# Altium schematic sheet MezzanineConnectors.SchDoc
size 420 x 297 mm; SheetNumber: 9; SheetTotal: 10; PageSetup: Record=PageOptions|CenterHorizontal=True|CenterVertical=True|PrintScale=0.96|XCorrection=1.00|YCorrection=1.00|PrintKind=1|BorderSize=5000000|LeftOffset=0|BottomOffset=0|Orientation=2|PaperLength=4318|PaperWidth=2794|Scale=100|PaperSource=7|PrintQuality=600|MediaType=1|DitherType=10|PaperKind=11" x 17"|PrintScaleMode=1
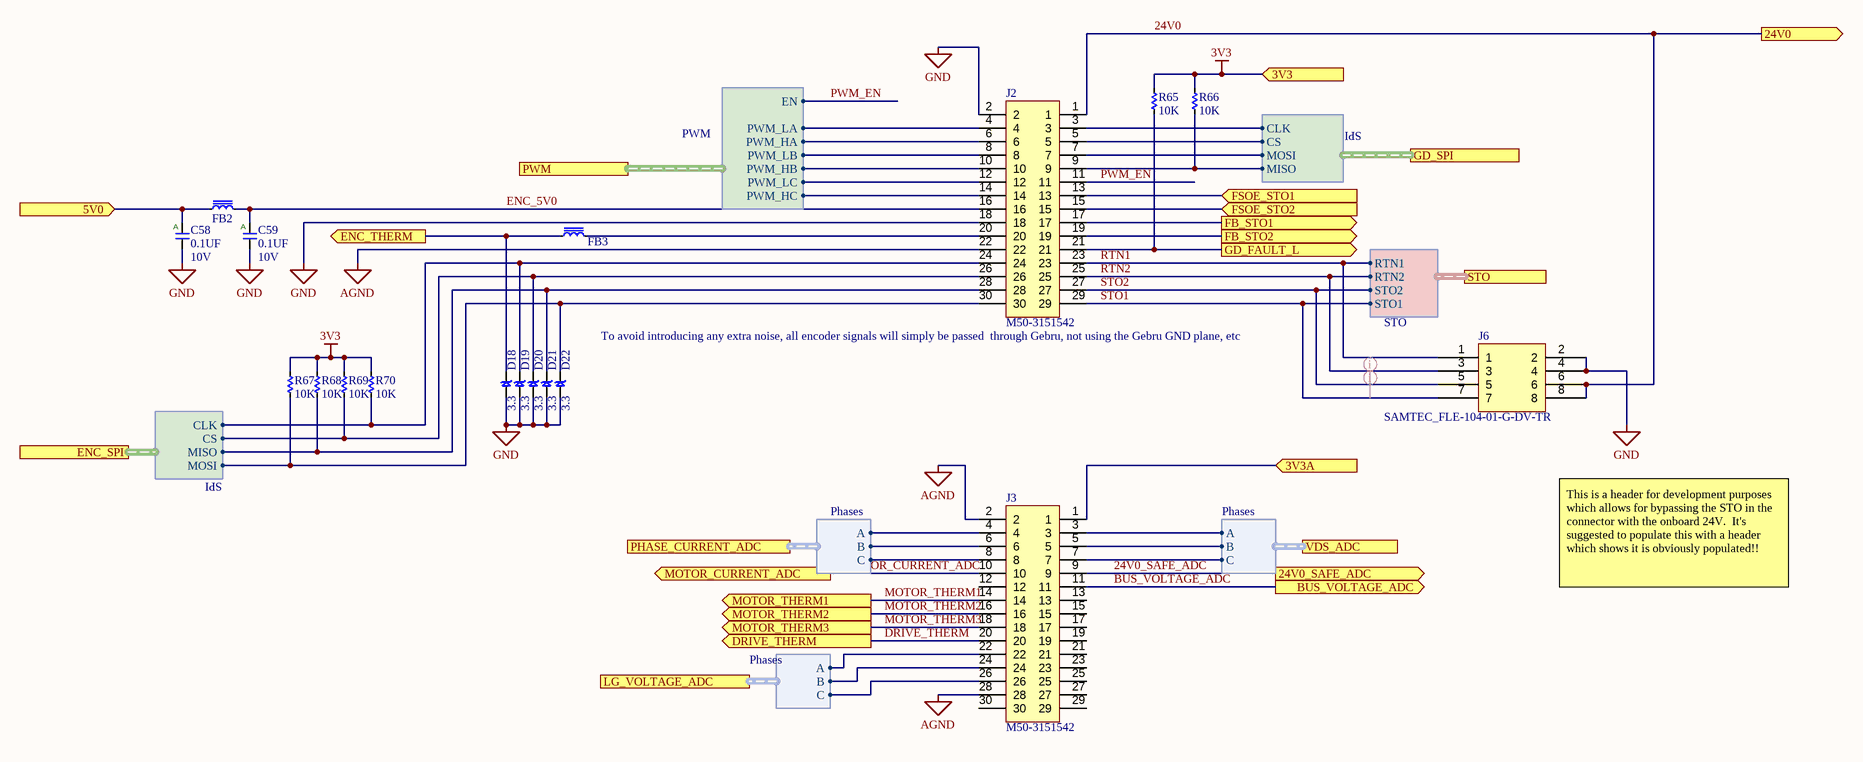
[diagram p0: MezzanineConnectors.SchDoc]

## Parts
C58  value 0.1UF  Voltage: 10V  [C0201Y]  (hidden comment: __Template_Cap_Auto)
C59  value 0.1UF  Voltage: 10V  [C0201Y]  (hidden comment: __Template_Cap_Auto)
D18  3.3  [SOD1060X40]
D19  3.3  [SOD1060X40]
D20  3.3  [SOD1060X40]
D21  3.3  [SOD1060X40]
D22  3.3  [SOD1060X40]
FB2  LAIRD MI0603L221R-10  [INDC160X80X105L30N]  (value not drawn)
FB3  LAIRD MI0603L221R-10  [INDC160X80X105L30N]  (value not drawn)
J2  MFG P/N: M50-3151542  [HARWIN_M50-3151542]
J3  MFG P/N: M50-3151542  [HARWIN_M50-3151542]
J6  SAMTEC_FLE-104-01-G-DV-TR  [SAMTEC_FLE-104-01-G-DV-TR]
R65  value 10K  [R0201_H0.26MM]  (hidden comment: __Template_Resistor)
R66  value 10K  [R0201_H0.26MM]  (hidden comment: __Template_Resistor)
R67  value 10K  [R0201_H0.26MM]  (hidden comment: __Template_Resistor)
R68  value 10K  [R0201_H0.26MM]  (hidden comment: __Template_Resistor)
R69  value 10K  [R0201_H0.26MM]  (hidden comment: __Template_Resistor)
R70  value 10K  [R0201_H0.26MM]  (hidden comment: __Template_Resistor)

## Ports
3V3 (in), 3V3A (in), 5V0 (in), 24V0 (out), 24V0_SAFE_ADC (out), BUS_VOLTAGE_ADC (out), DRIVE_THERM (out), ENC_SPI (harness SPI), ENC_THERM (out), FB_STO1 (out), FB_STO2 (out), FSOE_STO1 (in), FSOE_STO2 (in), GD_FAULT_L (out), GD_SPI (harness SPI), LG_VOLTAGE_ADC (harness Phases), MOTOR_CURRENT_ADC (out), MOTOR_THERM1 (out), MOTOR_THERM2 (out), MOTOR_THERM3 (out), PHASE_CURRENT_ADC (harness Phases), PWM (harness PWM), STO (harness STO), VDS_ADC (harness Phases)

## Harnesses
Phases: A, B, C
PWM: EN, PWM_HA, PWM_LA, PWM_HB, PWM_LB, PWM_HC, PWM_LC
SPI: CLK, CS, MOSI, MISO
STO: RTN1, RTN2, STO1, STO2

## Nets
3V3: R65.2 R66.2 R67.2 R68.2 R69.2 R70.2 ; port 3V3
AGND: J2.22 J3.2 J3.28
GND: C58.2 C59.2 D18.A D19.A D20.A D21.A D22.A J2.2 J2.18 J6.2 J6.4
3V3A: J3.1 ; port 3V3A
5V0: C58.1 FB2.1 ; port 5V0
24V0: J2.1 J6.6 J6.8 ; port 24V0
24V0_SAFE_ADC: J3.9 ; port 24V0_SAFE_ADC
BUS_VOLTAGE_ADC: J3.11 ; port BUS_VOLTAGE_ADC
DRIVE_THERM: J3.20 ; port DRIVE_THERM
ENC_5V0: C59.1 FB2.2 J2.16
ENC_THERM: D18.K FB3.1 ; port ENC_THERM
FB_STO1: J2.17 ; port FB_STO1
FB_STO2: J2.19 ; port FB_STO2
FSOE_STO1: J2.13 ; port FSOE_STO1
FSOE_STO2: J2.15 ; port FSOE_STO2
GD_FAULT_L: J2.21 R65.1 ; port GD_FAULT_L
MOTOR_CURRENT_ADC: J3.10 ; port MOTOR_CURRENT_ADC
MOTOR_THERM1: J3.14 ; port MOTOR_THERM1
MOTOR_THERM2: J3.16 ; port MOTOR_THERM2
MOTOR_THERM3: J3.18 ; port MOTOR_THERM3
PWM_EN: J2.11 ; port PWM.EN
RTN1: J2.23 J6.1 ; port STO.RTN1
RTN2: J2.25 J6.3 ; port STO.RTN2
STO1: J2.29 J6.7 ; port STO.STO1
STO2: J2.27 J6.5 ; port STO.STO2
NetD19_K: D19.K J2.24 R70.1 ; port ENC_SPI.CLK
NetD20_K: D20.K J2.26 R69.1 ; port ENC_SPI.CS
NetD21_K: D21.K J2.28 R68.1 ; port ENC_SPI.MISO
NetD22_K: D22.K J2.30 R67.1 ; port ENC_SPI.MOSI
NetFB3_2: FB3.2 J2.20
NetJ2_3: J2.3 ; port GD_SPI.CLK
NetJ2_4: J2.4 ; port PWM.PWM_LA
NetJ2_5: J2.5 ; port GD_SPI.CS
NetJ2_6: J2.6 ; port PWM.PWM_HA
NetJ2_7: J2.7 ; port GD_SPI.MOSI
NetJ2_8: J2.8 ; port PWM.PWM_LB
NetJ2_9: J2.9 R66.1 ; port GD_SPI.MISO
NetJ2_10: J2.10 ; port PWM.PWM_HB
NetJ2_12: J2.12 ; port PWM.PWM_LC
NetJ2_14: J2.14 ; port PWM.PWM_HC
NetJ3_3: J3.3 ; port VDS_ADC.A
NetJ3_4: J3.4 ; port PHASE_CURRENT_ADC.A
NetJ3_5: J3.5 ; port VDS_ADC.B
NetJ3_6: J3.6 ; port PHASE_CURRENT_ADC.B
NetJ3_7: J3.7 ; port VDS_ADC.C
NetJ3_8: J3.8 ; port PHASE_CURRENT_ADC.C
NetJ3_22: J3.22 ; port LG_VOLTAGE_ADC.A
NetJ3_24: J3.24 ; port LG_VOLTAGE_ADC.B
NetJ3_26: J3.26 ; port LG_VOLTAGE_ADC.C

Not connected (* = marked no-connect by the designer): J3 12 13 15 17 19 21 23 25 27 29 30

## Layout directives
net class 24V: STO1, STO2

## Notes on the sheet
- (near J2) To avoid introducing any extra noise, all encoder signals will simply be passed
  through Gebru, not using the Gebru GND plane, etc
- This is a header for development purposes which allows for bypassing the STO in the connector with the onboard 24V.  It's suggested to populate this with a header which shows it is obviously populated!!
- CREATIVE COMMONS
- PUBLIC LICENSE:
- BARKOUR ROBOT
- CC BY-NC 4.0
- APPROVED
- DWG NO
- GOOGLE LLC
- FILE
- RELEASED
- 2024/05/09
- SIZE
- 1600 AMPHITHEATRE PARKWAY
- MOUNTAIN VIEW CA 94043
- A3
- SHEET
- OF
- THIS DESIGN IS BEING PROVIDED  FOR NON-COMMERCIAL USE ONLY. THE USE OF =SCIENTIST_NAME_POSSESSIVE NAME IN CONNECTION WITH THE DESIGN IS NOT INTENDED TO IMPLY THAT =SCIENTIST_NAME SPONSORS OR ENDORSES THE DESIGN, GOOGLE LLC, OR ANY OF GOOGLE LLC'S PRODUCTS OR SERVICES.
- (in symbol 934) A

## Library data of the parts
C58 C59 = 934: CAP, CER, X6S, 0.1uF, 10V, 10%, 0201, AUTOGRADE; ID: 934; MFG: MURATA; MFG P/N: GRT033C81A104KE01D; XPN: 150-01178-00; Gecko: 150-04546-00; EES: 150-04563-00; Status: Released; Package: 0201; Dielectric: X6S; Tolerance: 10%; Height: 0.33mm T; Supplier 1: Digi-key; HelpURL: https://www.digikey.com/product-detail/en/murata-electronics/GRT033C81A104KE01D/490-12232-1-ND/5416933; ComponentLink1Description: Datasheet; ComponentLink1URL: https://search.murata.co.jp/Ceramy/image/img/A01X/G101/ENG/GRT033C81A104KE01-01.pdf; COMMON: 150-01178-00; LOON: 150-01178-00; Supplier Part Number 1: 490-12232-1-ND
D18-D22 = 192: TVS, DIODE, UNIDIR, 3.3VRWM, 4.8VBR, 7.8VCL, SOD-923; ID: 192; MFG: ON Semiconductor; MFG P/N: ESD9R3.3ST5G; Value: ESD9R3.3ST5G; Diode Type: Zener; PROXY: 480-01364-00; LOON: 430-00045-00; Voltage - Clamping (Max) @ Ipp: 7.8V; Status: Released; Package: SOD-923; Category: Diode; RoHS Compliant: Yes; Mounting Type: SMD; Operating Temperature – Junction: -55°C ~ 125°C (TJ); Supplier 1: Digi-Key; HelpURL: https://www.digikey.in/product-detail/en/on-semiconductor/ESD9R3.3ST5G/ESD9R3.3ST5GOSCT-ND/2704997; ComponentLink1Description: Datasheet; ComponentLink1URL: http://www.onsemi.com/pub/Collateral/ESD9R3.3S-D.PDF; Height: 0.4mm; Supplier Part Number 1: ESD9R3.3ST5GOSCT-ND
FB2 FB3 = LAIRD_MI0603L221R-10: LAIRD - MI0603L221R-10 - Ferrite Bead, 0603 [1608 Metric], 220 ohm, 2 A, MI Series, 0.05 ohm; Manufacturer: Laird Technologies; Grade: Commercial; Value: 220 Ohms @ 100 MHz; Current Rating: 2A; Number of Lines: 1; DC Resistance (DCR): 50mR; Impedance: 220R; Test Frequency: 100MHz; Shielding: Unshielded; Manufacturer Part Number: MI0603L221R-10; Package: Inductor, 0603; ComponentLink1Description: Datasheet; ComponentLink1URL: https://media.digikey.com/pdf/Data%20Sheets/Laird%20Technologies/EMI_Filtering_and_RF_Inductors.pdf; Category: Ferrite Beads; Status: Preliminary; Storage Temperature: -40 °C ~ 125 °C; Operating Temperature: -40 °C ~ 125 °C; Supplier 1: Mouser; Supplier Part Number 1: 875-MI0603L221R-10; RoHS: Yes; Stock 1: 2603; Pricing 1: 1=0.10000, 10=0.07000, 50=0.06400, 100=0.06400, 250=0.06000, 500=0.05600, 1000=0.05000, 4000=0.04800, 10000=0.04800 (USD); Mount: Surface Mount; Case/Package: 0603; Case Code (Metric): 1608; Case Code (Imperial): 0603; Weight: 0.000192oz; Core Material: Ferrite; Material: Ferrite; Min Operating Temperature: -40°C; Max Operating Temperature: 125°C; Packaging: Tape and Reel; Package Quantity: 1; Max Current Rating: 2A; Series: MI; Max DC Current: 2A; Termination: SMD/SMT; Length: 1.6mm; Width: 0.031inch; Height: 0.8mm; Depth: 0.8mm; REACH SVHC: Unknown; Lead Free: Lead Free; ComponentLink2URL: https://datasheet.ciiva.com/1013/mi0603l221r-10-1013287.pdf?src-supplier=Digi-Key; ComponentLink2Description: https://datasheet.ciiva.com/1013/mi0603l221r-10-1013287.pdf?src-supplier=Digi-Key; ComponentLink3URL: https://datasheet.ciiva.com/3082/mi0603l221r-10-c-vp-3082211.pdf?src-supplier=Avnet; ComponentLink3Description: https://datasheet.ciiva.com/3082/mi0603l221r-10-c-vp-3082211.pdf?src-supplier=Avnet; ComponentLink4URL: https://datasheet.ciiva.com/22650/1685986-22650407.pdf?src-supplier=Element14; ComponentLink4Description: https://datasheet.ciiva.com/22650/1685986-22650407.pdf?src-supplier=Element14
J2 J3 = 1205: CONN, RCPT, FEMALE, 30 P, 1.27MM, 2.45MM H, GOLD, SMD; ID: 1205; MFG: Harwin Inc.; Connector Type: Receptacle, Bottom or Top Entry; Number of Positions: 30; Current Rating: 1A; EES: 210-04983-00; Sub Assy Qty 2: 0; Status: Released; RoHS Compliant: Yes; Mounting Type: Surface Mount; Orientation: Vertical; Pitch: 1.27mm; Number of Rows: 2; Row Spacing: 1.27mm; Gender: Female; Features: Board Guide; Operating Temperature: -40°C ~ 105°C; Supplier 1: Digi-Key; HelpURL: https://www.digikey.com/en/products/detail/harwin-inc/M50-3151542/2762128; ComponentLink1Description: Datasheet; ComponentLink1URL: https://cdn.harwin.com/pdfs/M50-315.pdf; Height: 2.5mm; Supplier Part Number 1: 952-1707-ND; Sub Assy Qty 3: 0; Sub Assy Qty 4: 0
J6 = SAMTEC_FLE-104-01-G-DV-TR: CONN RCPT .05" 8POS DUAL SMD; Manufacturer: Samtec; Contact Resistance: 15mR; Number of Contacts: 8; Gender: Receptacle; Max Current Rating: 1.75A; Pitch: 1.27mm; Row Spacing: 0.05inch; Supplier 1: Digi-Key; Supplier Part Number 1: SAM1226-04-ND; Manufacturer Part Number: FLE-104-01-G-DV; RoHS: Yes; Category: Headers and Wire Housings; Stock 1: 413; Pricing 1: 1=1.50000, 10=1.35800, 25=1.27480, 50=1.21940, 100=1.16390, 250=1.05304, 500=0.96992 (USD); Mount: Surface Mount; Contact Plating: Gold; Contact Material: Bronze; Housing Color: Black; Housing Material: Polymer; Color: Black; Min Operating Temperature: -55°C; Max Operating Temperature: 125°C; Number of Rows: 2; Packaging: Bulk; Termination: Solder; Orientation: Straight; Connector Type: Receptacle; Number of Positions: 8; Series: FLE; Contact Type: Female Socket; Length: 5.19mm; Width: 3.33mm; Depth: 3.33mm; Radiation Hardening: No; REACH SVHC: No SVHC; Lead Free: Lead Free; ComponentLink1URL: https://datasheet.ciiva.com/747/fle-1xx-xx-xx-dv-x-mkt1-747009.pdf?src-supplier=Digi-Key; ComponentLink1Description: https://datasheet.ciiva.com/747/fle-1xx-xx-xx-dv-x-mkt1-747009.pdf?src-supplier=Digi-Key
R65-R70 = 6783: RES, 10K, 1%, 1/20W, 0201, AUTOGRADE; ID: 6783; MFG: PANASONIC; MFG P/N: ERJ1GNF1002C; COMMON: 470-00033-00; PROXY: Use ID #4151; EES: 470-18014-00; Status: Released; Package: 0201; Power: 1/20W; Tolerance: 1%; Height: 0.26mm; Supplier 1: Digi-Key; HelpURL: https://www.digikey.in/product-detail/en/panasonic-electronic-components/ERJ-1GNF1002C/P122414CT-ND/7389440; ComponentLink1Description: Datasheet; ComponentLink1URL: https://industrial.panasonic.com/cdbs/www-data/pdf/RDA0000/AOA0000C304.pdf; LOON: 470-00033-00; Gecko: 470-00033-00; XPN: 470-00033-00; Supplier Part Number 1: P122414CT-ND